# Altium schematic sheet Top Level.SchDoc
size A4
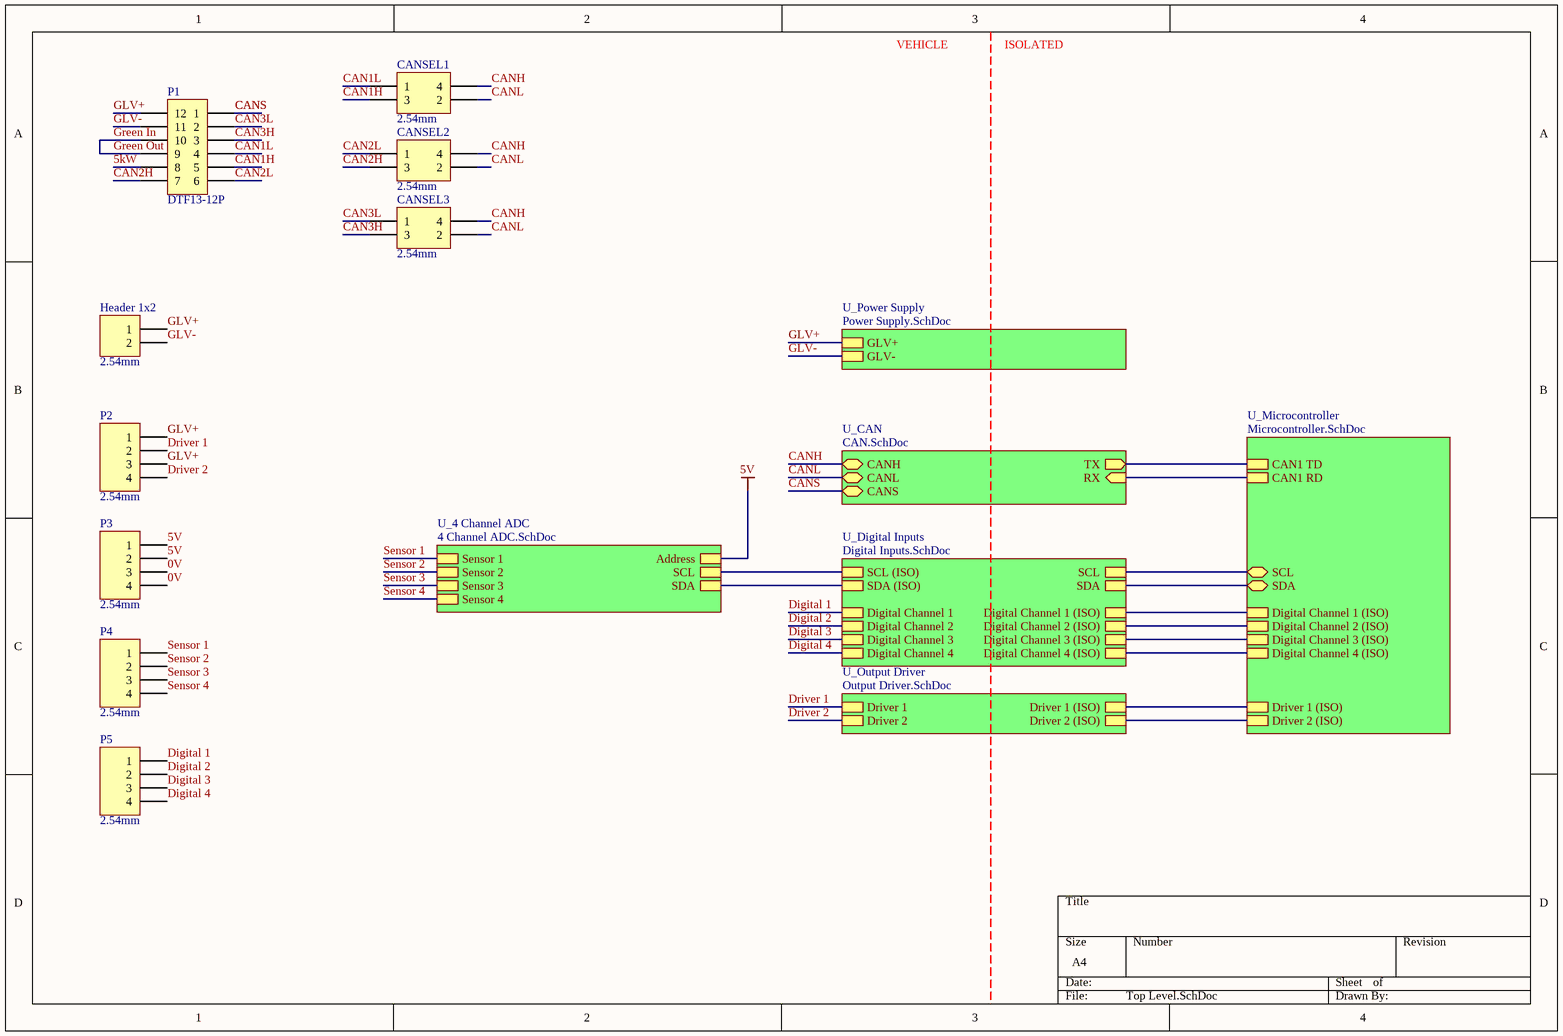
[diagram p0: Top Level.SchDoc]

## Parts
CANSEL1  2.54mm  [TH 2.54mm Header 2x2]
CANSEL2  2.54mm  [TH 2.54mm Header 2x2]
CANSEL3  2.54mm  [TH 2.54mm Header 2x2]
Header_1x2  2.54mm  [TH 5.08mm Header 1x2]
P1  DTF13-12P  [DTF13-12P]
P2  2.54mm  [TH 5.08mm Header 1x4]
P3  2.54mm  [TH 5.08mm Header 1x4]
P4  2.54mm  [TH 5.08mm Header 1x4]
P5  2.54mm  [TH 5.08mm Header 1x4]

## Sub-sheets
U_4 Channel ADC = 4 Channel ADC.SchDoc: Address, SCL, SDA, Sensor 1, Sensor 2, Sensor 3, Sensor 4
U_CAN = CAN.SchDoc: CANS (bidir), RX (in), CANL (bidir), CANH (bidir), TX (out)
U_Digital Inputs = Digital Inputs.SchDoc: Digital Channel 1, Digital Channel 2, Digital Channel 3, Digital Channel 4, Digital Channel 1 (ISO), Digital Channel 2 (ISO), Digital Channel 3 (ISO), Digital Channel 4 (ISO), SCL (ISO), SDA (ISO), SCL, SDA
U_Microcontroller = Microcontroller.SchDoc: CAN1 RD, CAN1 TD, SDA (bidir), SCL (bidir), Driver 1 (ISO), Driver 2 (ISO), Digital Channel 1 (ISO), Digital Channel 2 (ISO), Digital Channel 3 (ISO), Digital Channel 4 (ISO)
U_Output Driver = Output Driver.SchDoc: Driver 1, Driver 2, Driver 1 (ISO), Driver 2 (ISO)
U_Power Supply = Power Supply.SchDoc: GLV+, GLV-

## Nets
5V: P3.1 P3.2 ; sheet U_4 Channel ADC/Address
0V: P3.3 P3.4
5kW: P1.8
CAN1H: CANSEL1.3 P1.5
CAN1L: CANSEL1.1 P1.4
CAN2H: CANSEL2.3 P1.7
CAN2L: CANSEL2.1 P1.6
CAN3H: CANSEL3.3 P1.3
CAN3L: CANSEL3.1 P1.2
CANH: CANSEL1.4 CANSEL2.4 CANSEL3.4 ; sheet U_CAN/CANH
CANL: CANSEL1.2 CANSEL2.2 CANSEL3.2 ; sheet U_CAN/CANL
CANS: P1.1 ; sheet U_CAN/CANS
Digital 1: P5.1 ; sheet U_Digital Inputs/Digital Channel 1
Digital 2: P5.2 ; sheet U_Digital Inputs/Digital Channel 2
Digital 3: P5.3 ; sheet U_Digital Inputs/Digital Channel 3
Digital 4: P5.4 ; sheet U_Digital Inputs/Digital Channel 4
Driver 1: P2.2 ; sheet U_Output Driver/Driver 1
Driver 2: P2.4 ; sheet U_Output Driver/Driver 2
GLV+: Header_1x2.1 P1.12 P2.1 P2.3 ; sheet U_Power Supply/GLV+
GLV-: Header_1x2.2 P1.11 ; sheet U_Power Supply/GLV-
Green In: P1.9 P1.10  [also labelled Green Out]
Sensor 1: P4.1 ; sheet U_4 Channel ADC/Sensor 1
Sensor 2: P4.2 ; sheet U_4 Channel ADC/Sensor 2
Sensor 3: P4.3 ; sheet U_4 Channel ADC/Sensor 3
Sensor 4: P4.4 ; sheet U_4 Channel ADC/Sensor 4
(unnamed): sheet U_4 Channel ADC/SCL, sheet U_Digital Inputs/SCL (ISO)
(unnamed): sheet U_4 Channel ADC/SDA, sheet U_Digital Inputs/SDA (ISO)
(unnamed): sheet U_CAN/RX, sheet U_Microcontroller/CAN1 RD
(unnamed): sheet U_CAN/TX, sheet U_Microcontroller/CAN1 TD
(unnamed): sheet U_Output Driver/Driver 1 (ISO), sheet U_Microcontroller/Driver 1 (ISO)
(unnamed): sheet U_Output Driver/Driver 2 (ISO), sheet U_Microcontroller/Driver 2 (ISO)
(unnamed): sheet U_Microcontroller/SDA, sheet U_Digital Inputs/SDA
(unnamed): sheet U_Microcontroller/SCL, sheet U_Digital Inputs/SCL
(unnamed): sheet U_Microcontroller/Digital Channel 1 (ISO), sheet U_Digital Inputs/Digital Channel 1 (ISO)
(unnamed): sheet U_Microcontroller/Digital Channel 2 (ISO), sheet U_Digital Inputs/Digital Channel 2 (ISO)
(unnamed): sheet U_Microcontroller/Digital Channel 3 (ISO), sheet U_Digital Inputs/Digital Channel 3 (ISO)
(unnamed): sheet U_Microcontroller/Digital Channel 4 (ISO), sheet U_Digital Inputs/Digital Channel 4 (ISO)

## Notes on the sheet
- VEHICLE
- ISOLATED

## Library data of the parts
CANSEL1-CANSEL3 = TH 2.54mm Header 2x2: Positions: 4; Angle: 0; Flange: No; Contact: NA; Part Number: TH 2.54mm Header 2x2; Pitch: 2.54mm; Row Spacing: 2.54mm
Header_1x2 = TH 5.08mm Header 1x2: Positions: 2; Row Spacing: 5.08mm; Angle: 0; Flange: No; Contact: NA; Part Number: TH 5.08mm Header 1x2; Pitch: 2.54mm
P1 = DTF13-12P[[/\]]DTF13-12P: Positions: 12; Pitch: 4.45mm; Angle: 90; Flange: No; Contact: Copper Alloy; Part Number: DTF13-12P; Row Spacing: 4.45mm; Digikey Part Number: 1734-1861-ND; Digikey Link: https://www.digikey.com.au/product-detail/en/te-connectivity-deutsch-connectors/DTF13-12PA/1734-1861-ND/9744662
P2-P5 = TH 5.08mm Header 1x4: Positions: 4; Row Spacing: 5.08mm; Angle: 0; Flange: No; Contact: NA; Part Number: TH 5.08mm Header 1x4; Pitch: 2.54mm